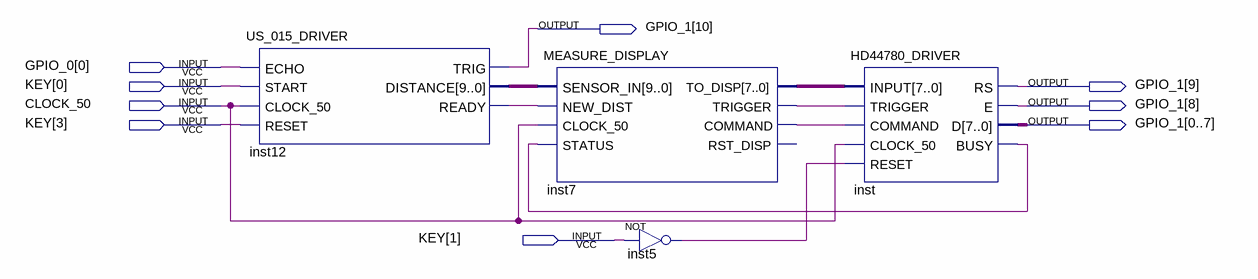
[diagram p0: schematic sheet]
// Quartus schematic distance_measure.bdf as structural Verilog: 4 symbols, 9 pins
module distance_measure (
  input  [0:0] GPIO_0,
  input  [3:0] KEY,
  input  CLOCK_50,
  output [0:10] GPIO_1
);

  wire inst5_out, inst7_command, inst7_trigger, inst12_ready, inst_busy;
  wire [7:0] inst7_to_disp;
  wire [9:0] inst12_distance;

  US_015_DRIVER inst12 (
    .ECHO(GPIO_0[0]), .START(KEY[0]), .CLOCK_50(CLOCK_50), .RESET(KEY[3]), .TRIG(GPIO_1[10]),
    .DISTANCE(inst12_distance), .READY(inst12_ready));
  MEASURE_DISPLAY inst7 (
    .SENSOR_IN(inst12_distance), .NEW_DIST(inst12_ready), .CLOCK_50(CLOCK_50), .STATUS(inst_busy),
    .TO_DISP(inst7_to_disp), .TRIGGER(inst7_trigger), .COMMAND(inst7_command));  // open: RST_DISP
  not inst5 (inst5_out, KEY[1]);
  HD44780_DRIVER inst (
    .INPUT(inst7_to_disp), .TRIGGER(inst7_trigger), .COMMAND(inst7_command), .CLOCK_50(CLOCK_50),
    .RESET(inst5_out), .RS(GPIO_1[9]), .E(GPIO_1[8]), .D(GPIO_1[0:7]), .BUSY(inst_busy));
endmodule
